# Altium schematic sheet DIRECTIONAL_COUPLER.SchDoc
size A4
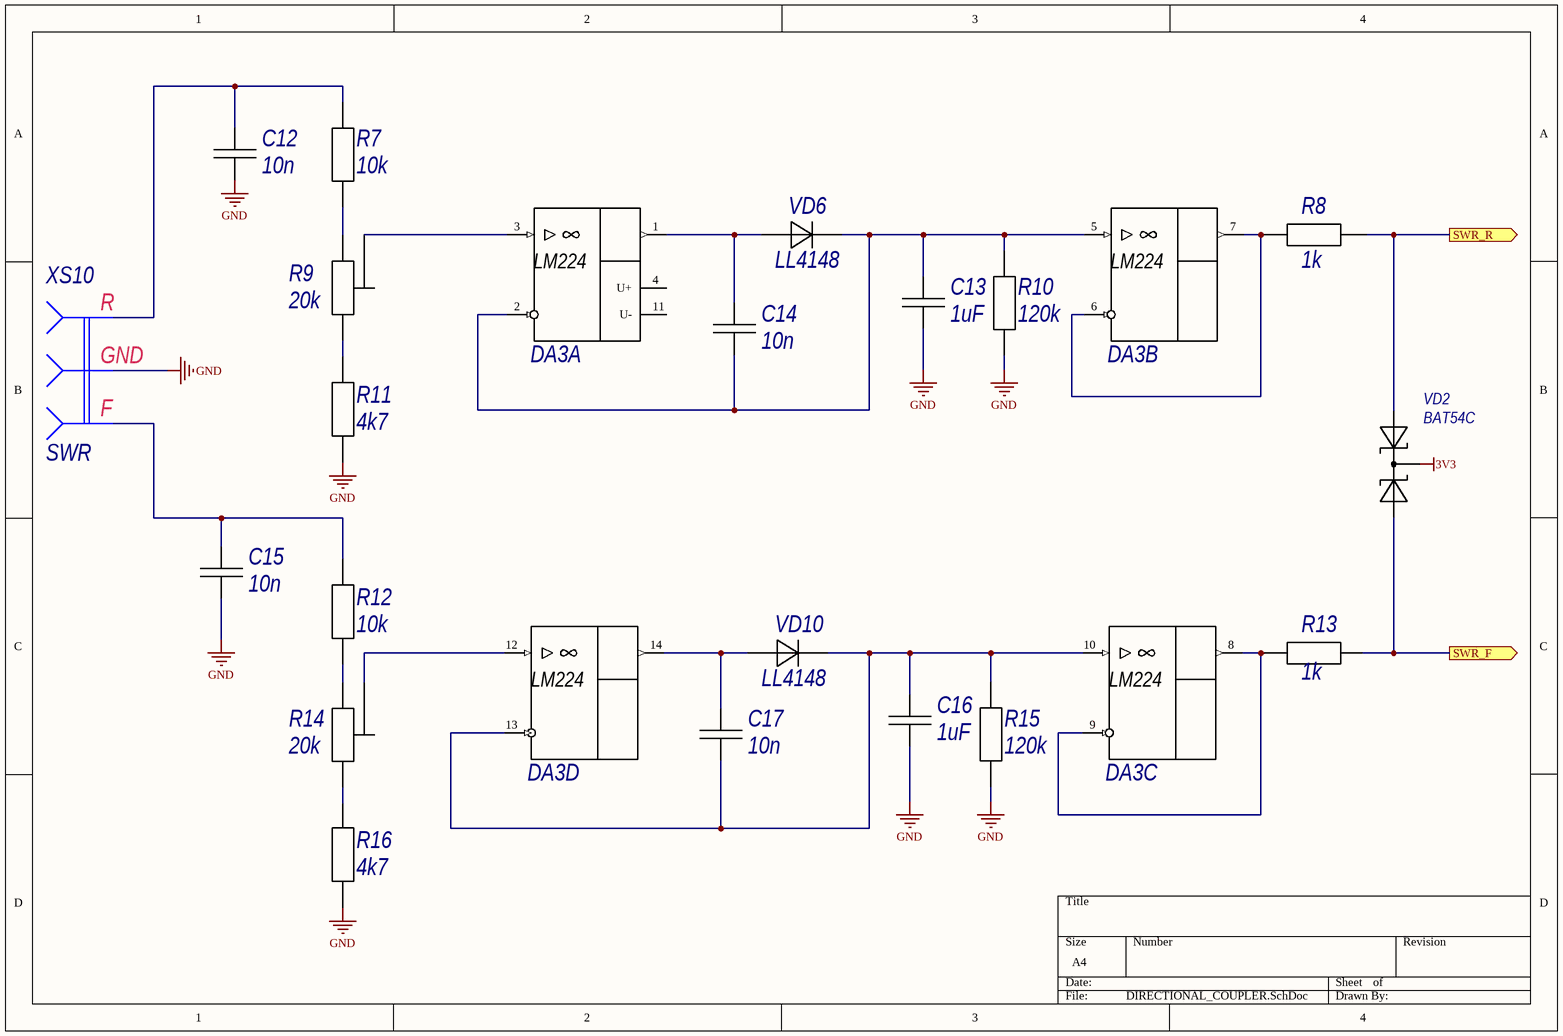
[diagram p0: DIRECTIONAL_COUPLER.SchDoc]

## Parts
C12  10n  [C0805C]
C13  1uF  [C0805C]
C14  10n  [C0805C]
C15  10n  [C0805C]
C16  1uF  [C0805C]
C17  10n  [C0805C]
DA3  LM224  [Texas_Instruments_D0014A_IPC_A]  (value not drawn)  (parts A,B,C,D of 4)
R7  10k  [C0805R]
R8  1k  [C0805R]
R9  20k  [TRIM_3296W-1-254LF]
R10  120k  [C0805R]
R11  4k7  [C0805R]
R12  10k  [C0805R]
R13  1k  [C0805R]
R14  20k  [TRIM_3296W-1-254LF]
R15  120k  [C0805R]
R16  4k7  [C0805R]
VD2  BAT54C  [BAT54C_SOT23-3]
VD6  LL4148  [DIO_LL4148]
VD10  LL4148  [DIO_LL4148]
XS10  SWR

## Ports
SWR_F (out), SWR_R (out)

## Nets
3V3: VD2.3(AC)
GND: C12.1 C13.1 C15.1 C16.1 R10.2 R11.1 R15.1 R16.1 XS10.2
SWR_F: R13.1 VD2.2(C) ; port SWR_F
SWR_R: R8.1 VD2.1(А1) ; port SWR_R
NetC12_2: C12.2 R7.2 XS10.1
NetC13_2: C13.2 C14.1 DA3.2(IN-) DA3.5(IN+) R10.1 VD6.2(К)
NetC14_2: C14.2 DA3.1(OUT) VD6.1(А)
NetC15_2: C15.2 R12.2 XS10.3
NetC16_2: C16.2 C17.1 DA3.10(IN+) DA3.13(IN-) R15.2 VD10.2(К)
NetC17_2: C17.2 DA3.14(OUT) VD10.1(А)
NetDA3_3: DA3.3(IN+) R9.2
NetDA3_6: DA3.6(IN-) DA3.7(OUT) R8.2
NetDA3_8: DA3.8(OUT) DA3.9(IN-) R13.2
NetDA3_12: DA3.12(IN+) R14.2
NetR7_1: R7.1 R9.1
NetR9_3: R9.3 R11.2
NetR12_1: R12.1 R14.1
NetR14_3: R14.3 R16.2

Not connected (* = marked no-connect by the designer): DA3 4(U+) 11(U-)

## Notes on the sheet
- (in symbol DIR_COUP) R; GND; F

## Library data of the parts
C12-C17 = CAP_0805: Type: Конденсатор; Published: 18.05.2010; Publisher: Andrew Danich
R7 R8 R10-R13 R15 R16 = RES_0805: Published: 24.03.2010; Publisher: Andrew Danich; Type: Резистор
R9 R14 = Resistor-Trimmer-1: Publisher: Andrew Danich; Type: Подстроечный резистор; Published: 27.07.2015
VD2 = BAT54C: Small Signal Schottky Diode, Dual Common Cathode, 30 V, 200 mA, 400 mV, 600 mA, 125 C
VD6 VD10 = LL4148: Type: Диод; Published: 18.05.2010; Publisher: Andrew Danich
XS10 = DIR_COUP: Published: 07.03.2013; Publisher: Andrew Danich; Type: Розетка
DA3 = LM224: Published: 29.07.2015; Publisher: Andrew Danich; Type: Микросхема